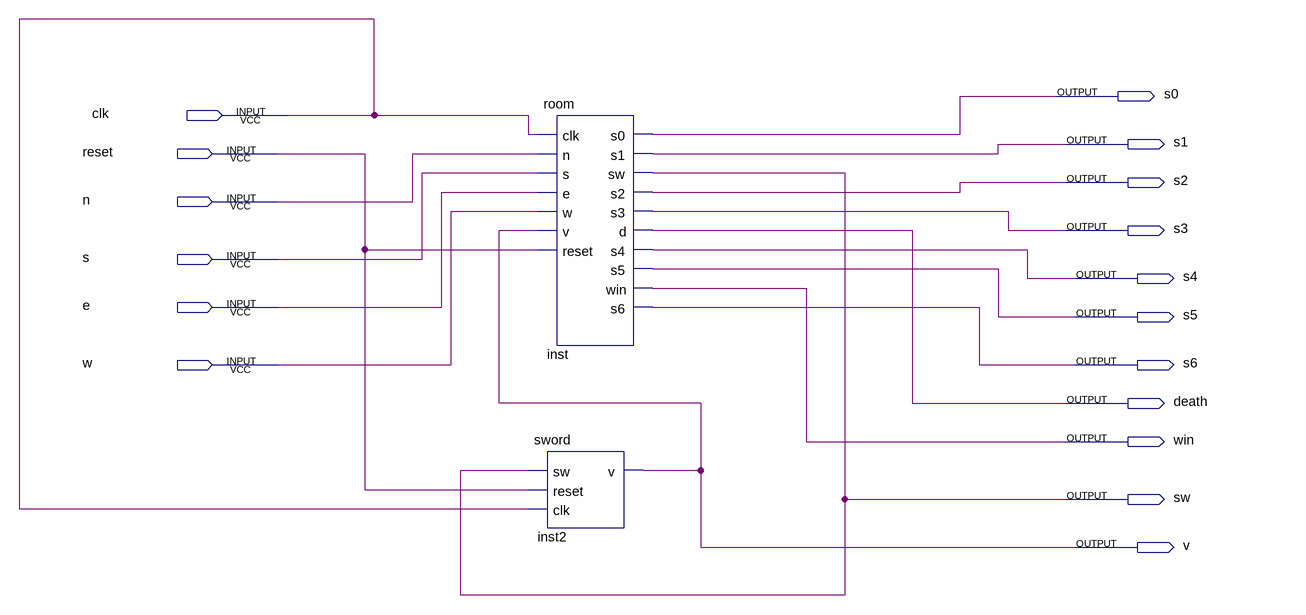
[diagram p0: schematic sheet]
// Quartus schematic Game.bdf as structural Verilog: 2 symbols, 17 pins
module Game (
  input  clk,
  input  reset,
  input  n,
  input  s,
  input  e,
  input  w,
  output s0,
  output s1,
  output s2,
  output s3,
  output s4,
  output s5,
  output s6,
  output death,
  output win,
  output sw,
  output v
);

  room inst (
    .clk(clk), .n(n), .s(s), .e(e), .w(w), .v(v), .reset(reset), .s0(s0), .s1(s1), .sw(sw), .s2(s2), .s3(s3),
    .d(death), .s4(s4), .s5(s5), .win(win), .s6(s6));
  sword inst2 (.sw(sw), .reset(reset), .clk(clk), .v(v));
endmodule
